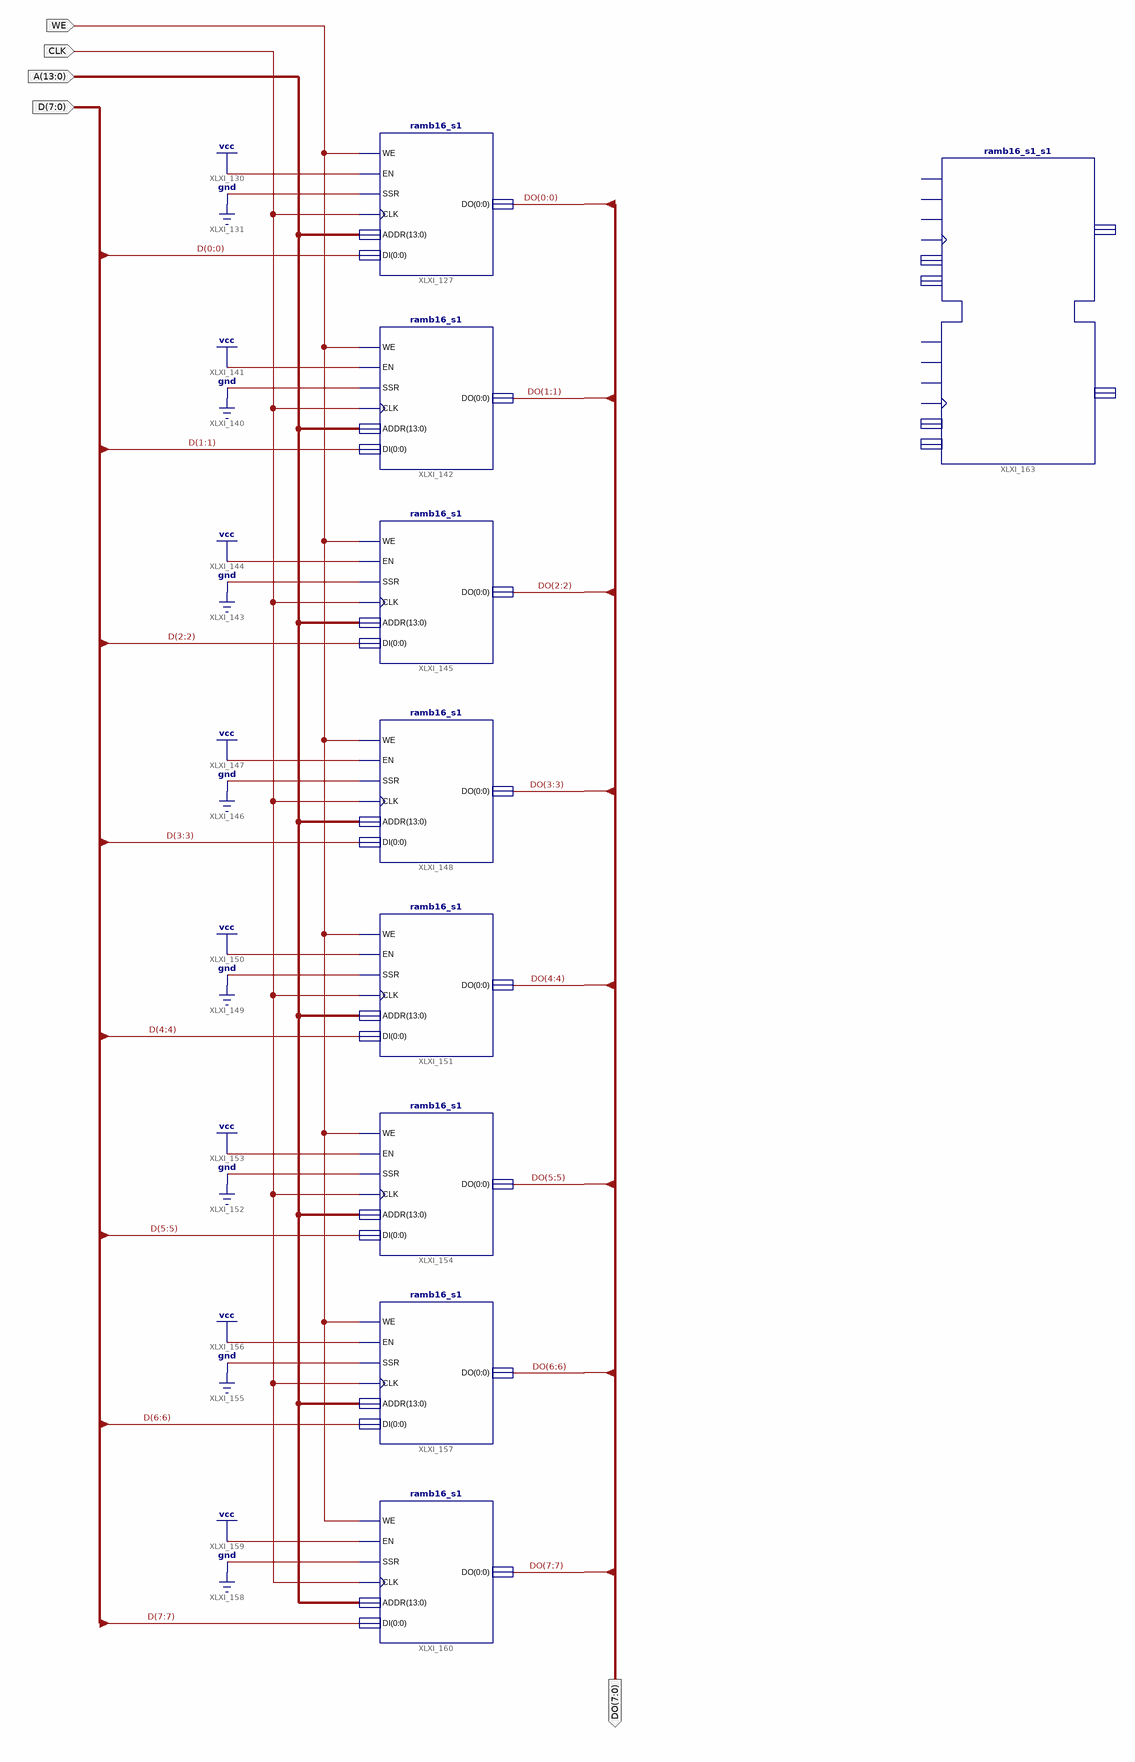
[diagram p0: schematic sheet 1]
// Xilinx ISE schematic RAM_A14_D8.sch (spartan3) as structural Verilog: 9 symbols, 5 ports
module RAM_A14_D8 (
  input  [7:0] D,
  input  [13:0] A,
  input  CLK,
  input  WE,
  output [7:0] DO
);

  ramb16_s1 XLXI_127 (.ADDR(A), .CLK(CLK), .DI(D[0]), .EN(1'b1), .SSR(1'b0), .WE(WE), .DO(DO[0]));
  ramb16_s1 XLXI_142 (.ADDR(A), .CLK(CLK), .DI(D[1]), .EN(1'b1), .SSR(1'b0), .WE(WE), .DO(DO[1]));
  ramb16_s1 XLXI_145 (.ADDR(A), .CLK(CLK), .DI(D[2]), .EN(1'b1), .SSR(1'b0), .WE(WE), .DO(DO[2]));
  ramb16_s1 XLXI_148 (.ADDR(A), .CLK(CLK), .DI(D[3]), .EN(1'b1), .SSR(1'b0), .WE(WE), .DO(DO[3]));
  ramb16_s1 XLXI_151 (.ADDR(A), .CLK(CLK), .DI(D[4]), .EN(1'b1), .SSR(1'b0), .WE(WE), .DO(DO[4]));
  ramb16_s1 XLXI_154 (.ADDR(A), .CLK(CLK), .DI(D[5]), .EN(1'b1), .SSR(1'b0), .WE(WE), .DO(DO[5]));
  ramb16_s1 XLXI_157 (.ADDR(A), .CLK(CLK), .DI(D[6]), .EN(1'b1), .SSR(1'b0), .WE(WE), .DO(DO[6]));
  ramb16_s1 XLXI_160 (.ADDR(A), .CLK(CLK), .DI(D[7]), .EN(1'b1), .SSR(1'b0), .WE(WE), .DO(DO[7]));
  ramb16_s1_s1 XLXI_163 ();  // open: ADDRA, ADDRB, CLKA, CLKB, DIA, DIB, ENA, ENB, SSRA, SSRB, WEA, WEB, DOA, DOB
endmodule
